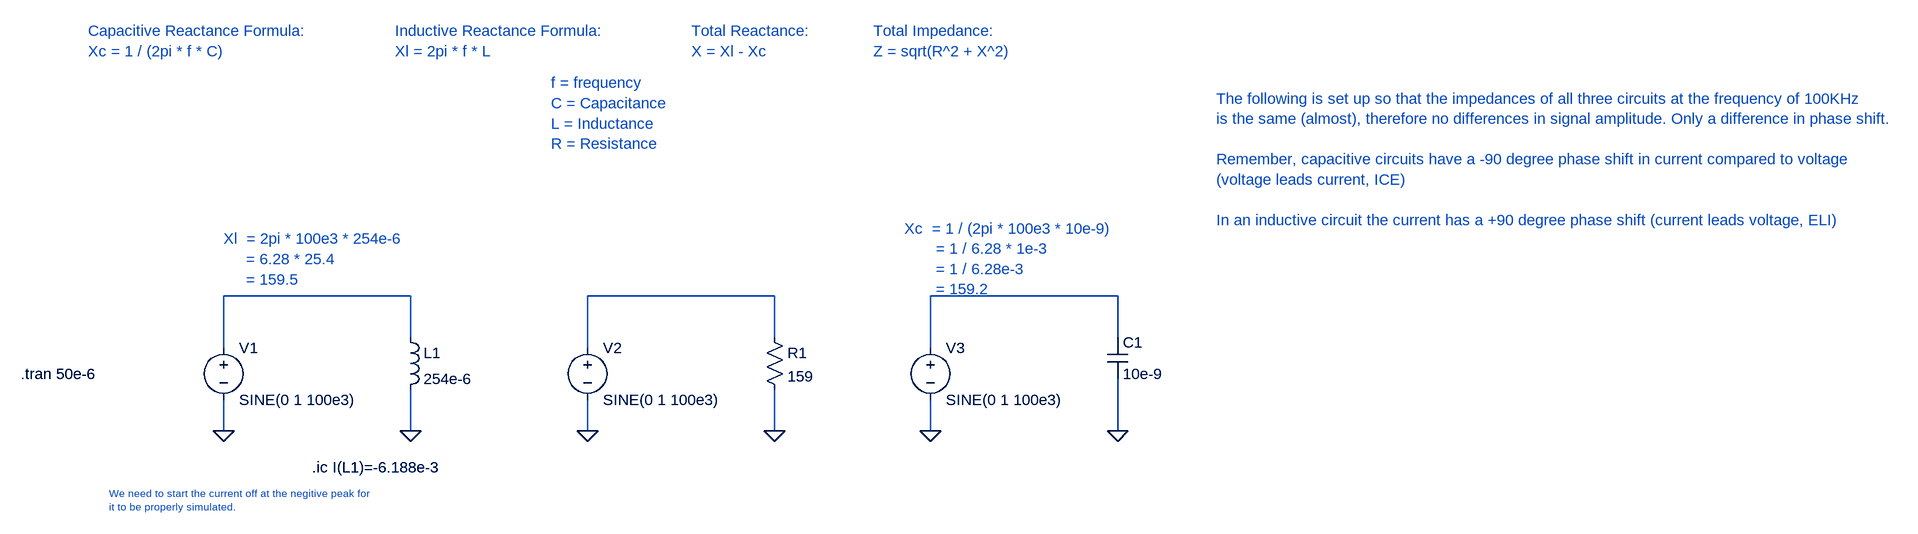
[diagram p0: schematic Impedance Pt1.asc]
Impedance Pt1.asc, the LTspice schematic file:
Version 4
SHEET 1 2688 680
WIRE 304 48 16 48
WIRE 864 48 576 48
WIRE 1392 48 1104 48
WIRE 304 112 304 48
WIRE 864 112 864 48
WIRE 1392 112 1392 48
WIRE 16 128 16 48
WIRE 576 128 576 48
WIRE 1104 128 1104 48
WIRE 16 256 16 208
WIRE 304 256 304 192
WIRE 576 256 576 208
WIRE 864 256 864 192
WIRE 1104 256 1104 208
WIRE 1392 256 1392 176
FLAG 16 256 0
FLAG 304 256 0
FLAG 576 256 0
FLAG 864 256 0
FLAG 1104 256 0
FLAG 1392 256 0
SYMBOL voltage 16 112 R0
WINDOW 123 0 0 Left 0
WINDOW 39 0 0 Left 0
SYMATTR InstName V1
SYMATTR Value SINE(0 1 100e3)
SYMBOL ind 288 96 R0
SYMATTR InstName L1
SYMATTR Value 254e-6
SYMBOL voltage 576 112 R0
WINDOW 123 0 0 Left 0
WINDOW 39 0 0 Left 0
SYMATTR InstName V2
SYMATTR Value SINE(0 1 100e3)
SYMBOL voltage 1104 112 R0
WINDOW 123 0 0 Left 0
WINDOW 39 0 0 Left 0
SYMATTR InstName V3
SYMATTR Value SINE(0 1 100e3)
SYMBOL res 848 96 R0
SYMATTR InstName R1
SYMATTR Value 159
SYMBOL cap 1376 112 R0
SYMATTR InstName C1
SYMATTR Value 10e-9
TEXT -296 168 Left 2 !.tran 50e-6
TEXT 152 312 Left 2 !.ic I(L1)=-6.188e-3
TEXT 1544 -256 Left 2 ;The following is set up so that the impedances of all three circuits at the frequency of 100KHz\nis the same (almost), therefore no differences in signal amplitude. Only a difference in phase shift.\n \nRemember, capacitive circuits have a -90 degree phase shift in current compared to voltage\n(voltage leads current, ICE) \n \nIn an inductive circuit the current has a +90 degree phase shift (current leads voltage, ELI)
TEXT -160 352 Left 1 ;We need to start the current off at the negitive peak for\nit to be properly simulated.
TEXT -192 -360 Left 2 ;Capacitive Reactance Formula:\nXc = 1 / (2pi * f * C)
TEXT 280 -360 Left 2 ;Inductive Reactance Formula:\nXl = 2pi * f * L
TEXT 520 -280 Left 2 ;f = frequency\nC = Capacitance\nL = Inductance\nR = Resistance
TEXT 736 -360 Left 2 ;Total Reactance:\nX = Xl - Xc
TEXT 1016 -360 Left 2 ;Total Impedance:\nZ = sqrt(R^2 + X^2)
TEXT 1064 -56 Left 2 ;Xc  = 1 / (2pi * 100e3 * 10e-9)\n       = 1 / 6.28 * 1e-3\n       = 1 / 6.28e-3\n       = 159.2
TEXT 16 -40 Left 2 ;Xl  = 2pi * 100e3 * 254e-6\n     = 6.28 * 25.4\n     = 159.5

The netlist it stands for:
* Impedance Pt1.asc
V1 N001 0 SINE(0 1 100e3)
L1 N001 0 254e-6
V2 N002 0 SINE(0 1 100e3)
V3 N003 0 SINE(0 1 100e3)
R1 N002 0 159
C1 N003 0 10e-9
.tran 50e-6
.ic I(L1)=-6.188e-3
* The following is set up so that the impedances of all three circuits at the frequency of 100KHz
* is the same (almost), therefore no differences in signal amplitude. Only a difference in phase shift.
* Remember, capacitive circuits have a -90 degree phase shift in current compared to voltage
* (voltage leads current, ICE)
* In an inductive circuit the current has a +90 degree phase shift (current leads voltage, ELI)
* We need to start the current off at the negitive peak for
* it to be properly simulated.
* Capacitive Reactance Formula:
* Xc = 1 / (2pi * f * C)
* Inductive Reactance Formula:
* Xl = 2pi * f * L
* f = frequency
* C = Capacitance
* L = Inductance
* R = Resistance
* Total Reactance:
* X = Xl - Xc
* Total Impedance:
* Z = sqrt(R^2 + X^2)
* Xc  = 1 / (2pi * 100e3 * 10e-9)
*        = 1 / 6.28 * 1e-3
*        = 1 / 6.28e-3
*        = 159.2
* Xl  = 2pi * 100e3 * 254e-6
*      = 6.28 * 25.4
*      = 159.5
.backanno
.end